# Altium schematic sheet flash.SchDoc
size A4; SheetNumber: 4; SheetTotal: 8
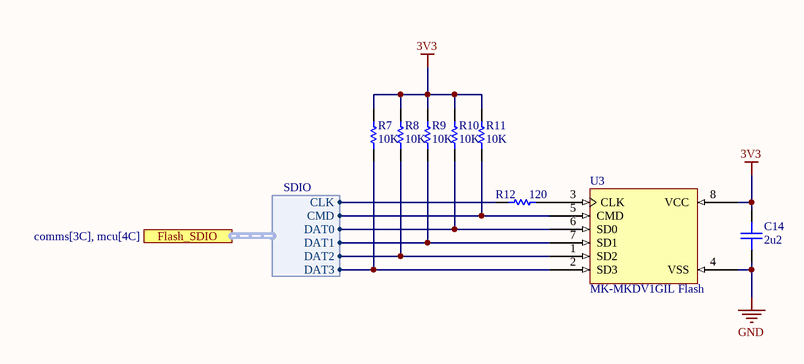
[diagram p0: flash.SchDoc]

## Parts
C14  2u2
R7  10K
R8  10K
R9  10K
R10  10K
R11  10K
R12  120
U3  MK-MKDV1GIL Flash

## Ports
Flash_SDIO (harness SDIO, see comms[3C], mcu[4C])

## Harnesses
SDIO: CLK, CMD, DAT0, DAT1, DAT2, DAT3

## Nets
3V3: C14.2 R7.2 R8.2 R9.2 R10.2 R11.2 U3.8(VCC)
GND: C14.1 U3.4(VSS)
NetR7_1: R7.1 U3.2(SD3) ; port Flash_SDIO.DAT3
NetR8_1: R8.1 U3.1(SD2) ; port Flash_SDIO.DAT2
NetR9_1: R9.1 U3.7(SD1) ; port Flash_SDIO.DAT1
NetR10_1: R10.1 U3.6(SD0) ; port Flash_SDIO.DAT0
NetR11_1: R11.1 U3.5(CMD) ; port Flash_SDIO.CMD
NetR12_1: R12.1 U3.3(CLK)
NetR12_2: R12.2 ; port Flash_SDIO.CLK

## Library data of the parts
C14 = Capacitor
R7-R12 = Resistor
U3 = MK-MKDV1GIL: 1Gbit LGA-8(6x8) SD NAND FLASH ROHS